# EAGLE design House_Illumination_Core (EAGLE 7.5.0)
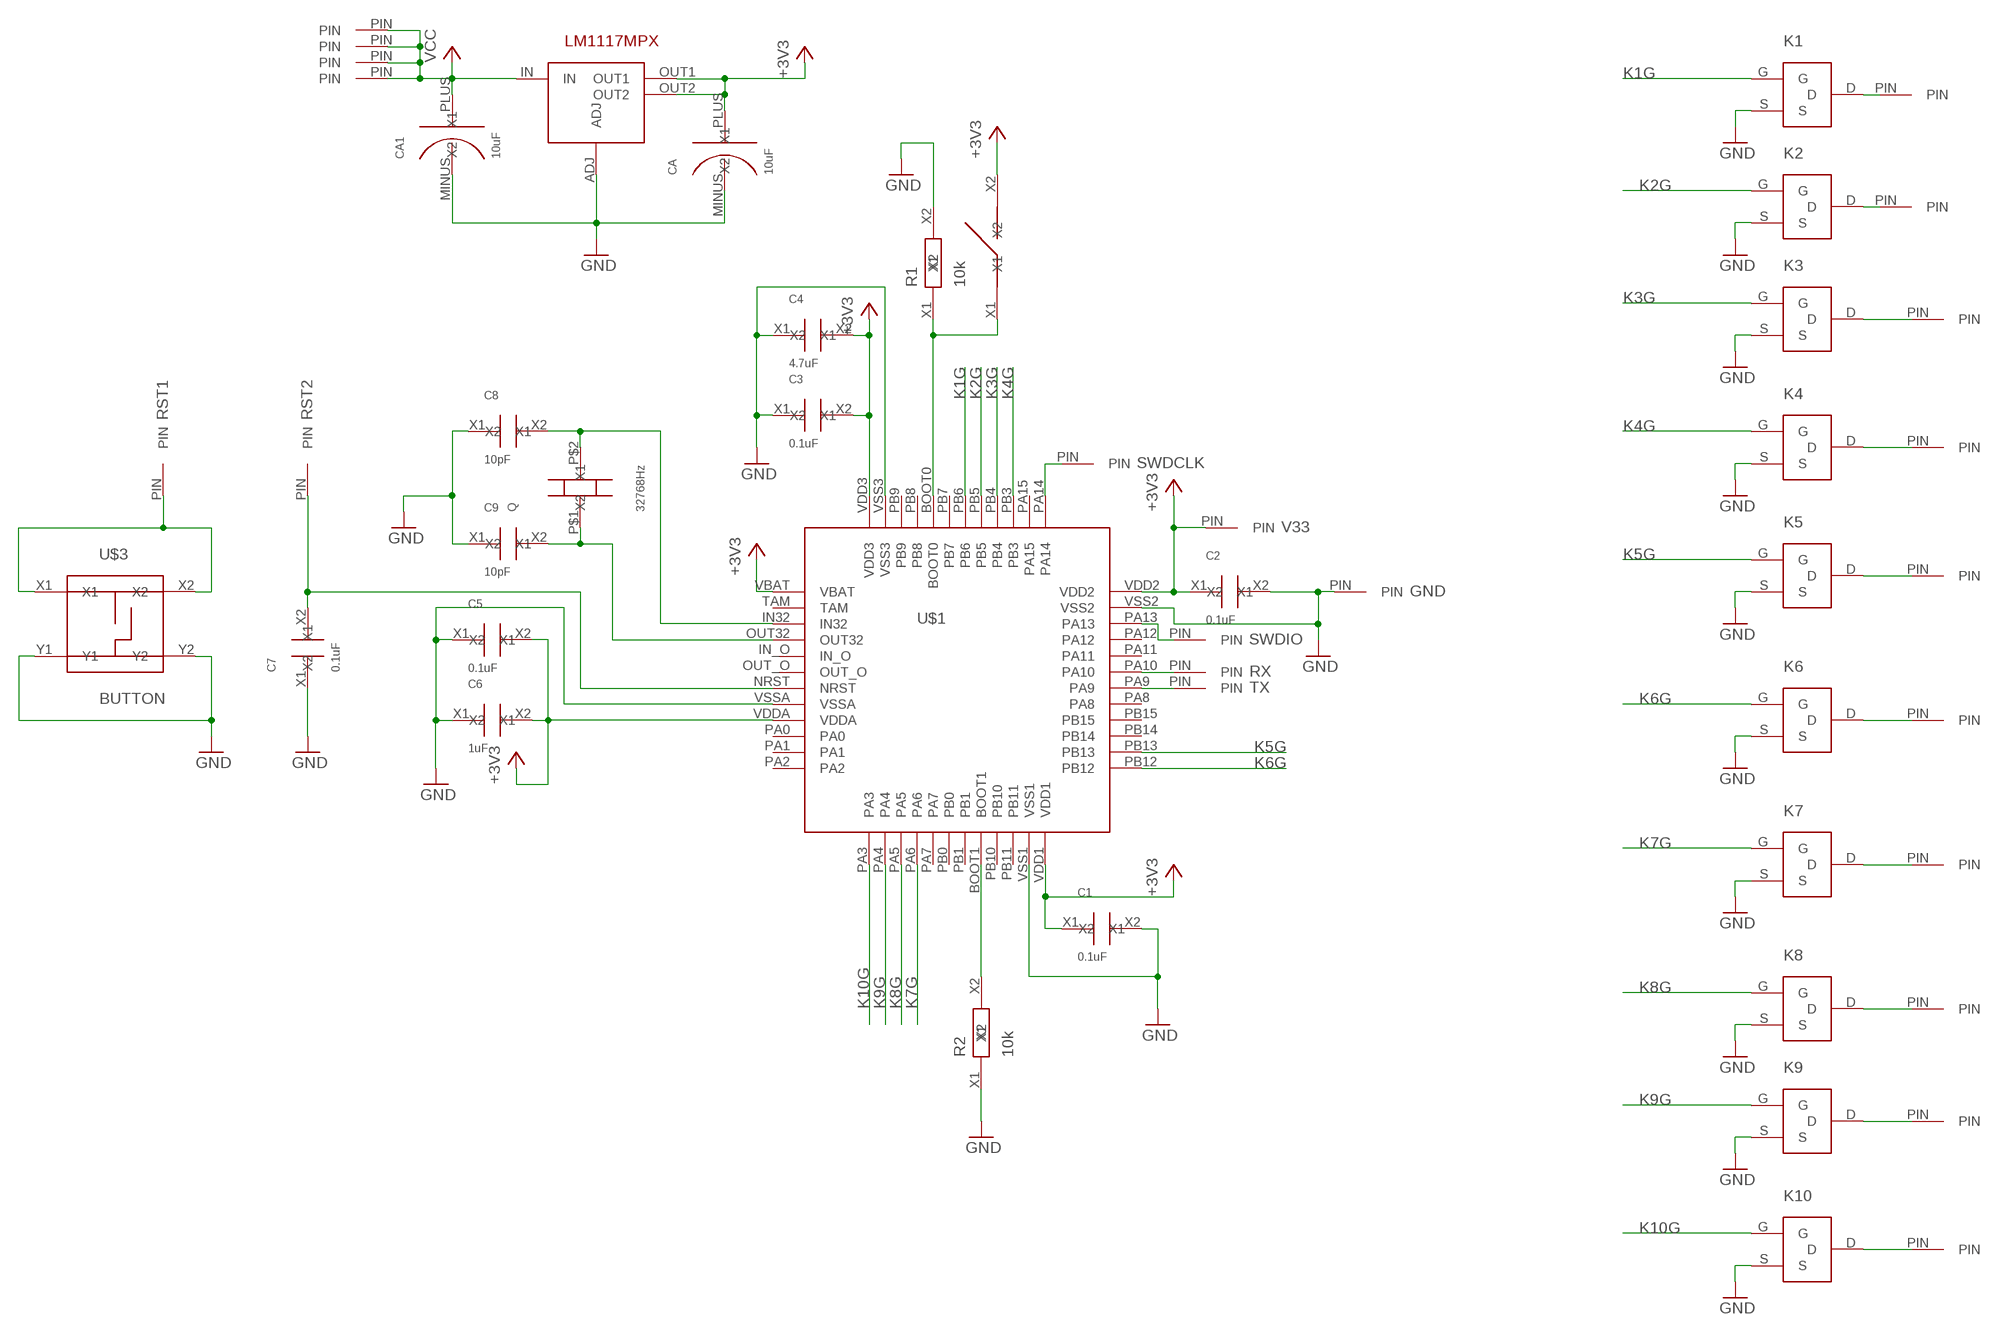
[diagram p0: schematic, sheet 1]

## Parts
C1  0.1uF  C_SMD_2.1X1.25  [SMD_2.1X1.25]
C2  0.1uF  C_SMD_2.1X1.25  [SMD_2.1X1.25]
C3  0.1uF  C_SMD_2.1X1.25  [SMD_2.1X1.25]
C4  4.7uF  C_SMD_2.1X1.25  [SMD_2.1X1.25]
C5  0.1uF  C_SMD_2.1X1.25  [SMD_2.1X1.25]
C6  1uF  C_SMD_2.1X1.25  [SMD_2.1X1.25]
C7  0.1uF  C_SMD_2.1X1.25  [SMD_2.1X1.25]
C8  10pF  C_SMD_2.1X1.25  [SMD_2.1X1.25]
C9  10pF  C_SMD_2.1X1.25  [SMD_2.1X1.25]
CA  10uF  C_SMD_TA_A  [C_SMD_TA_A]
CA1  10uF  C_SMD_TA_A  [C_SMD_TA_A]
GND  PIN  [PIN]
K1  IRFML8244TRPBF  [IRFML8244TRPBF]
K2  IRFML8244TRPBF  [IRFML8244TRPBF]
K3  IRFML8244TRPBF  [IRFML8244TRPBF]
K4  IRFML8244TRPBF  [IRFML8244TRPBF]
K5  IRFML8244TRPBF  [IRFML8244TRPBF]
K6  IRFML8244TRPBF  [IRFML8244TRPBF]
K7  IRFML8244TRPBF  [IRFML8244TRPBF]
K8  IRFML8244TRPBF  [IRFML8244TRPBF]
K9  IRFML8244TRPBF  [IRFML8244TRPBF]
K10  IRFML8244TRPBF  [IRFML8244TRPBF]
LED1  PIN_1  [PIN_1]
LED2  PIN_1  [PIN_1]
LED3  PIN_1  [PIN_1]
LED4  PIN_1  [PIN_1]
LED5  PIN_1  [PIN_1]
LED6  PIN_1  [PIN_1]
LED7  PIN_1  [PIN_1]
LED8  PIN_1  [PIN_1]
LED9  PIN_1  [PIN_1]
LED10  PIN_1  [PIN_1]
Q  32768Hz  QUARTZ_CYL  [QUARTZ_CYL]
R1  10k  R_SMD_2.1X1.25  [SMD_2.1X1.25]
R2  10k  R_SMD_2.1X1.25  [SMD_2.1X1.25]
RST1  PIN  [PIN]
RST2  PIN  [PIN]
RX  PIN  [PIN]
SWDCLK  PIN  [PIN]
SWDIO  PIN  [PIN]
TX  PIN  [PIN]
U$1  STM32F103CBT6  [STM32F103CBT6]
U$2  DIP_1  [DIP_1]
U$3  BUTTON  [BUTTON]
U$13  LM1117MPX-ADJ  [LM1117MPX-ADJ]
V33  PIN  [PIN]
VCCPIN  PIN_1  [PIN_1]
VCCPIN1  PIN_1  [PIN_1]
VCCPIN2  PIN_1  [PIN_1]
VCCPIN3  PIN_1  [PIN_1]

## Nets
+3V3: C1.X1 C2.X1 C3.X2 C4.X2 C5.X2 C6.X2 CA.PLUS(X2) U$1.VBAT U$1.VDD1 U$1.VDD2 U$1.VDD3 U$1.VDDA U$2.X2 U$13.OUT1 U$13.OUT2 V33.PIN
GND: C1.X2 C2.X2 C3.X1 C4.X1 C5.X1 C6.X1 C7.X1 C8.X1 C9.X1 CA1.MINUS(X1) CA.MINUS(X1) GND.PIN K1.S K2.S K3.S K4.S K5.S K6.S K7.S K8.S K9.S K10.S R1.X2 R2.X1 U$1.VSS1 U$1.VSS2 U$1.VSS3 U$1.VSSA U$3.Y1 U$3.Y2 U$13.ADJ
K1G: K1.G U$1.PB6
K2G: K2.G U$1.PB5
K3G: K3.G U$1.PB4
K4G: K4.G U$1.PB3
K5G: K5.G U$1.PB13
K6G: K6.G U$1.PB12
K7G: K7.G U$1.PA6
K8G: K8.G U$1.PA5
K9G: K9.G U$1.PA4
K10G: K10.G U$1.PA3
N$1: R2.X2 U$1.BOOT1
N$2: C9.X2 Q.P$1(X1) U$1.OUT32
N$3: C8.X2 Q.P$2(X2) U$1.IN32
N$4: SWDCLK.PIN U$1.PA14
N$5: C7.X2 RST2.PIN U$1.NRST
N$6: R1.X1 U$1.BOOT0 U$2.X1
N$7: K7.D LED7.PIN
N$8: SWDIO.PIN U$1.PA13
N$9: RX.PIN U$1.PA10
N$10: TX.PIN U$1.PA9
N$11: RST1.PIN U$3.X1 U$3.X2
N$17: K1.D LED1.PIN
N$21: K3.D LED3.PIN
N$22: K4.D LED4.PIN
N$23: K5.D LED5.PIN
N$24: K6.D LED6.PIN
N$25: K10.D LED10.PIN
N$26: K9.D LED9.PIN
N$27: K8.D LED8.PIN
N$28: K2.D LED2.PIN
VCC: CA1.PLUS(X2) U$13.IN VCCPIN1.PIN VCCPIN2.PIN VCCPIN3.PIN VCCPIN.PIN
Unconnected: U$1.IN_O U$1.OUT_O U$1.PA0 U$1.PA1 U$1.PA2 U$1.PA7 U$1.PA8 U$1.PA11 U$1.PA12 U$1.PA15 U$1.PB0 U$1.PB1 U$1.PB7 U$1.PB8 U$1.PB9 U$1.PB10 U$1.PB11 U$1.PB14 U$1.PB15 U$1.TAM

## Library data of the parts
C1-C9 = MyPowerComponents:C_SMD_2.1X1.25
CA CA1 = MyAmSys:C_SMD_TA_A
GND RST1 RST2 RX SWDCLK SWDIO TX V33 = MySTM32F103RGT6:PIN
K1-K10 = My_STM32:IRFML8244TRPBF
LED1-LED10 VCCPIN VCCPIN1-VCCPIN3 = My_BLE:PIN_1
Q = MySTM32F103RGT6:QUARTZ_CYL
R1 R2 = MyPowerComponents:R_SMD_2.1X1.25
U$1 = My_STM32:STM32F103CBT6
U$2 = My_STM32L15x:DIP_1
U$3 = My_STM32:BUTTON
U$13 = My_OPT:LM1117MPX-ADJ

## Board
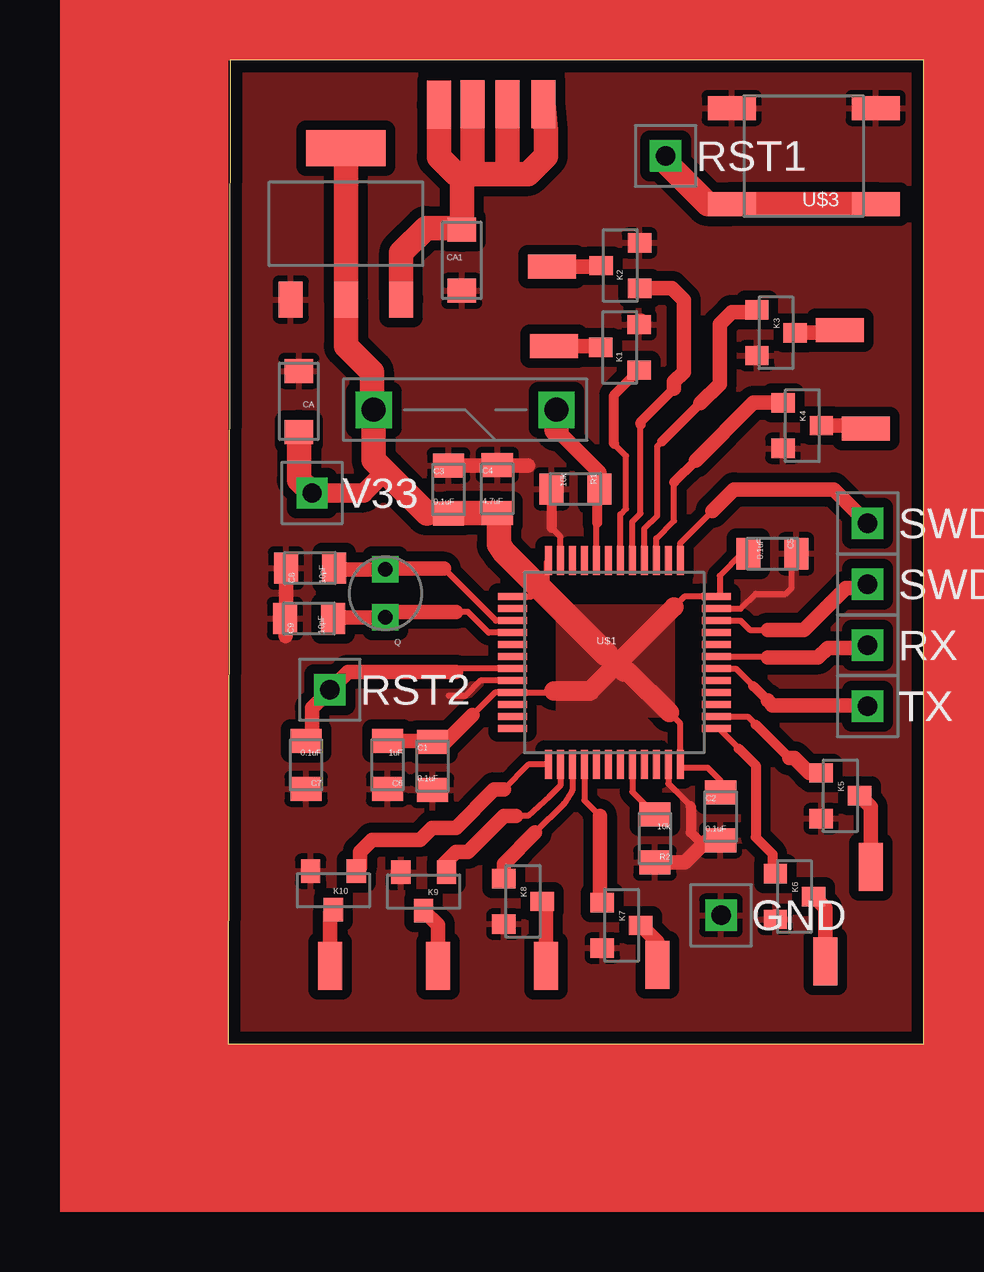
[diagram p1: board, top side]
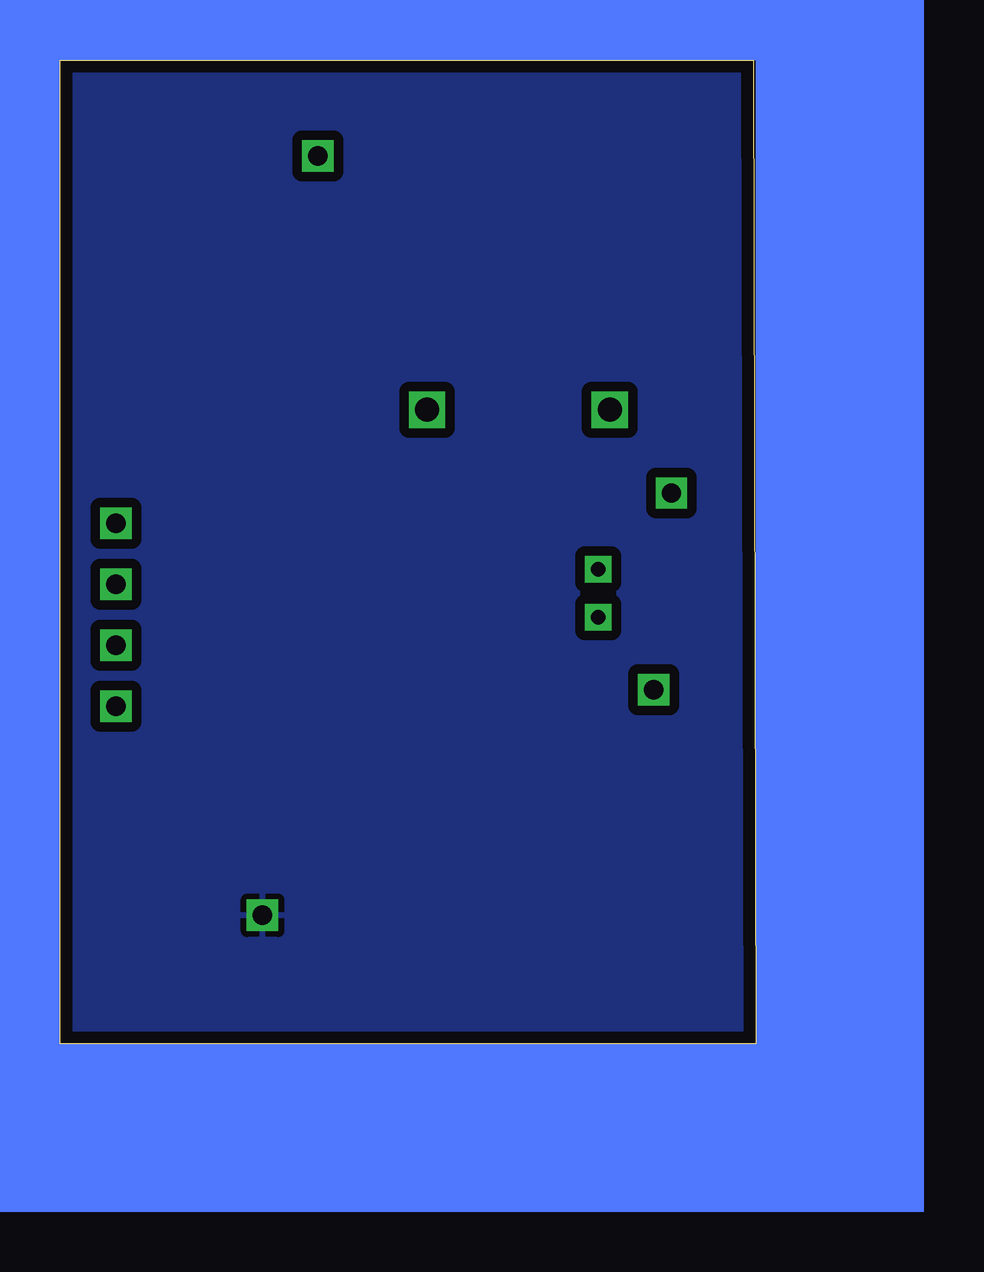
[diagram p2: board, bottom side, seen from below]

Size 29 x 41 mm. Coordinates in mm from the lower left corner, seen from the top.
Outline: 0,0 29,0 29,41 0.1,41 0,0
Copper layers (1*16): Top 0.035mm / dielectric 1.5mm / Bottom 0.035mm
Design rules "default *": minimum track width 10mil, minimum drill 24mil, track to track 8mil, track to pad 8mil, pad to pad 8mil, via to via 8mil, smd to smd 8mil, copper to edge 20mil, drill to drill 8mil, minimum pad ring 10mil, minimum via ring 8mil, stop-mask expansion 4mil, vias tented up to drill 0mil, thermal gap 10mil

### Footprints (pad centres in the part's own frame; a part is rotated, then mirrored left to right if it is on the bottom)
SMD_2.1X1.25 = smd 1.3 x 1: X1 0,1; X2 0,-1
C_SMD_TA_A = smd 1.2 x 1: MINUS 0,-1.27; PLUS 0,1.27
PIN = drill 0.8 square: PIN 0,0
IRFML8244TRPBF = smd 0.802 x 0.972: D 0,0.8; G -0.95,-0.8; S 0.95,-0.8
PIN_1 = smd 2 x 1: PIN 0,0
QUARTZ_CYL = drill 0.6 square: P$1 0,1; P$2 0,-1
STM32F103CBT6 = smd 0.3 x 1.2: BOOT0 -0.75,4.25; BOOT1 0.75,-4.25; PA3 -2.75,-4.25; PA4 -2.25,-4.25; PA5 -1.75,-4.25; PA6 -1.25,-4.25; PA7 -0.75,-4.25; PA14 2.75,4.25; PA15 2.25,4.25; PB0 -0.25,-4.25; PB1 0.25,-4.25; PB3 1.75,4.25; PB4 1.25,4.25; PB5 0.75,4.25; PB6 0.25,4.25; PB7 -0.25,4.25; PB8 -1.25,4.25; PB9 -1.75,4.25; PB10 1.25,-4.25; PB11 1.75,-4.25; VDD1 2.75,-4.25; VDD3 -2.75,4.25; VSS1 2.25,-4.25; VSS3 -2.25,4.25 | smd 1.2 x 0.3: IN32 -4.25,1.75; IN_O -4.25,0.75; NRST -4.25,-0.25; OUT32 -4.25,1.25; OUT_O -4.25,0.25; PA0 -4.25,-1.75; PA1 -4.25,-2.25; PA2 -4.25,-2.75; PA8 4.25,-0.75; PA9 4.25,-0.25; PA10 4.25,0.25; PA11 4.25,0.75; PA12 4.25,1.25; PA13 4.25,1.75; PB12 4.25,-2.75; PB13 4.25,-2.25; PB14 4.25,-1.75; PB15 4.25,-1.25; TAM -4.25,2.25; VBAT -4.25,2.75; VDD2 4.25,2.75; VDDA -4.25,-1.25; VSS2 4.25,2.25; VSSA -4.25,-0.75
DIP_1 = drill 1 square: X1 0,2.54; X2 0,-5.08
BUTTON = smd 2 x 1: X1 -3,2; X2 3,2; Y1 -3,-2; Y2 3,-2
LM1117MPX-ADJ = smd 1 x 1.5: ADJ -2.3,-6.3; IN 2.3,-6.3; OUT1 0,-6.3 | smd 3.3 x 1.5: OUT2 0,0

### Placement (x,y rotation side)
C1  8.53,11.57 0 top
C2  20.54,9.47 0 top
C3  9.2,23.1 0 top
C4  11.23,23.12 0 top
C5  22.69,20.42 270 top
C6  6.65,11.62 180 top
C7  3.26,11.62 180 top
C8  3.42,19.82 90 top
C9  3.38,17.72 90 top
CA  2.96,26.77 180 top
CA1  9.75,32.65 0 top
GND  20.56,5.35 0 top
K1  16.34,29.02 90 top
K2  16.36,32.43 90 top
K3  22.85,29.63 270 top
K4  23.94,25.76 270 top
K5  25.53,10.33 270 top
K6  23.62,6.13 270 top
K7  16.41,4.93 270 top
K8  12.3,5.93 270 top
K9  8.16,6.34 180 top
K10  4.4,6.39 180 top
LED1  13.6,29.08 180 top
LED2  13.5,32.39 0 top
LED3  25.5,29.75 0 top
LED4  26.6,25.64 0 top
LED5  26.8,7.37 90 top
LED6  24.9,3.43 270 top
LED7  17.9,3.29 270 top
LED8  13.25,3.25 90 top
LED9  8.75,3.25 90 top
LED10  4.25,3.25 270 top
Q  6.57,18.77 180 top
R1  14.49,23.12 270 top
R2  17.8,8.55 180 top
RST1  18.25,37 0 top
RST2  4.25,14.75 0 top
RX  26.67,16.61 0 top
SWDCLK  26.67,21.68 0 top
SWDIO  26.67,19.14 0 top
TX  26.67,14.06 0 top
U$1  16.11,15.88 0 top
U$2  11.16,26.42 270 top
U$3  24,37 180 top
U$13  4.92,37.32 0 top
V33  3.51,22.95 0 top
VCCPIN  8.8,39.13 90 top
VCCPIN1  10.2,39.15 90 top
VCCPIN2  11.65,39.15 90 top
VCCPIN3  13.15,39.15 90 top

### Tracks (layer width: path | path; a pad name or v marks a point on that pad's centre or on a via)
+3V3
  Top 0.254: 10.2,13.7 11.13,14.63 U$1.VDDA 13.53,14.63 13.6,14.7 | U$1.VDD1 | U$1.VDD2 20.83,18.63 | U$1.VBAT 12.63,18.63 13,19 13.3,19.3 13.3,20.07 U$1.VDD3 | U$1.VDD2 19.03,18.63 18.6,18.2 | U$1.VDD1 18.86,13.34 18.4,13.8 | C5.X2 21.42,20.42 20.5,19.5 20.5,18.77 U$1.VDD2 | C2.X1 20.54,10.96 20,11.5 18.99,11.5 U$1.VDD1
  Top 0.305: 13.4,18.6 13,19
  Top 0.406: 11.3,22.05 C4.X2 | 13.8,18.2 13.4,18.6
  Top 0.61: 10.2,13.7 9.07,12.57 C1.X1 8.48,12.62 C6.X2 | 9.72,22.12 C3.X2
  Top 0.813: 8.3,22.1 C3.X2 | 18.6,18.2 16.2,15.8 | 16.2,15.8 15.75,16.25 13.8,18.2 | 13.6,14.7 15.1,14.7 16.2,15.8 | 18.4,13.8 16.7,15.5 16.5,15.5 16.2,15.8 | 6.55,23.85 5.65,22.95 V33.PIN 3.46,23
  Top 1.016: 8.3,22.1 6.55,23.85 6.08,24.32 U$2.X2 6,26.5 6,28 4.92,29.08 U$13.OUT1 U$13.OUT2 | 11.3,22.05 11.3,20.8 11.5,20.5 15.75,16.25 | C4.X2 9.22,22.12 C3.X2 | CA.PLUS 2.96,23.5 V33.PIN
  Bottom 0.813: 6,26.5 U$2.X2
  pour Top (isolate 0.406): 13.8,18.2 18.5,18.2 18.5,13.7 13.8,13.7
GND
  Top 0.254: U$1.VSSA 10.53,15.13 9.9,14.5 9.2,14.5 | U$1.VSS1 18.36,10.84 19.3,9.9 | U$1.VSS3 13.86,21.14 13.5,21.5 | C5.X1 23.5,20.23 23.5,19 23.25,18.75 22,18.75 21.38,18.13 U$1.VSS2
  Top 0.406: 19.3,9.9 19.3,8.8 19.7,8.4 19.9,8.4 20.47,8.4 C2.X2 | 13.5,21.5 R1.X2
  Top 0.61: C8.X1 2.42,17.76 C9.X1 2.4,17.7 2.4,17 | R2.X1 19.05,7.55 19.9,8.4 | C3.X1 11.71,24.1 C4.X1 11.75,24.1 12.5,24.1 | R1.X2
  Top 0.813: 17.2,30.03 K1.S | 22.8,5.2 K6.S
  pour Bottom (isolate 0.406): 0,0 29,0 29,41 0,41
  pour Top (isolate 0.406): 0,0 29,0 29,41 0,41
K1G
  Top 0.254: U$1.PB6 16.36,22.06 16.6,22.3 16.6,24.5 16.1,25
  Top 0.406: 16.1,25 16.1,27.03 K1.G
K2G
  Top 0.254: U$1.PB5 16.86,21.76 17.2,22.1 17.2,25.8
  Top 0.406: 17.2,25.8 17.2,25.9 18.6,27.3
  Top 0.61: 18.6,27.3 18.6,27.6 19,28 19,31 18.5,31.5 17.18,31.5 K2.G
K3G
  Top 0.254: U$1.PB4 17.36,21.46 17.9,22 17.9,24.9 18.1,25.1
  Top 0.406: 18.1,25.1 19.7,26.7
  Top 0.61: 19.7,26.7 20.5,27.5 20.5,30 21,30.5 21.97,30.5 K3.G
K4G
  Top 0.254: U$1.PB3 17.86,21.06 18.6,21.8 18.6,23.4
  Top 0.406: 18.6,23.4 19.5,24.3
  Top 0.61: 19.5,24.3 21.91,26.71 K4.G
K5G
  Top 0.254: U$1.PB13 21.67,13.63 22,13.3
  Top 0.406: 22,13.3 23.4,11.9
  Top 0.61: 23.4,11.9 23.61,11.9 24.23,11.28 K5.G
K6G
  Top 0.254: U$1.PB12 20.47,13.13 21.3,12.3
  Top 0.406: 21.3,12.3 22,11.6 22,8.6 22.7,7.9 22.7,7.2 K6.G
K7G
  Top 0.254: U$1.PA6 14.86,10.14 15.5,9.5
  Top 0.61: 15.5,9.5 15.5,5.99 K7.G
K8G
  Top 0.254: U$1.PA5 14.36,10.56 14,10 12.8,8.8
  Top 0.61: 12.8,8.8 11.5,7.5 K8.G
K9G
  Top 0.254: U$1.PA4 13.86,10.76 13.4,10.3 12.5,9.5 12,9.5
  Top 0.61: K9.G 9,7.25 9,7.5 9.5,8 10,8 11.5,9.5 12,9.5
K10G
  Top 0.254: U$1.PA3 12.53,11.63 11.5,10.6
  Top 0.61: 11.5,10.6 11.1,10.6 9.5,9 8.5,9 8,8.5 6,8.5 5.5,8 5.5,7.34 K10.G
N$1
  Top 0.254: U$1.BOOT1 16.86,10.49 R2.X2
N$2
  Top 0.254: U$1.OUT32 10.87,17.13 10,18 9.5,18
  Top 0.61: C9.X2 4.43,17.77 Q.P$1 6.8,18 9.5,18
N$3
  Top 0.254: U$1.IN32 11.17,17.63 9,19.8
  Top 0.61: 9,19.8 6.6,19.8 Q.P$2 4.47,19.77 C8.X2
N$4
  Top 0.254: U$1.PA14 18.86,20.86 20.2,22.2
  Top 0.61: 20.2,22.2 21.1,23.1 25.25,23.1 SWDCLK.PIN
N$5
  Top 0.254: U$1.NRST 9.63,15.63 9.5,15.5
  Top 0.61: 9.5,15.5 5,15.5 4.75,15.25 RST2.PIN 3.5,14 3.5,12.86 C7.X2
N$6
  Top 0.254: U$1.BOOT0 15.36,21.66 15.4,21.7
  Top 0.406: 15.4,21.7 15.4,23.03 R1.X1
  Top 0.61: R1.X1 15.49,23.81 13.7,25.6
  Top 1.016: 13.7,25.6 U$2.X1
N$7
  Top 0.61: LED7.PIN 17.9,4.24 K7.D
N$8
  Top 0.254: U$1.PA13 21.37,17.63 21.75,17.25 22.5,17.25
  Top 0.61: SWDIO.PIN 26.52,19 25.75,19 24,17.25 22.5,17.25
N$9
  Top 0.254: U$1.PA10 22.47,16.13 22.5,16.1
  Top 0.61: 22.5,16.1 24.6,16.1 25,16.5 26.57,16.5 RX.PIN
N$10
  Top 0.254: U$1.PA9 21.17,15.63 21.9,14.9
  Top 0.406: 21.9,14.9 22.5,14.3
  Top 0.61: 22.5,14.3 22.7,14.1 26.64,14.1 TX.PIN
N$11
  Top 1.016: U$3.X1 21.5,35 U$3.X2 20,35 18.25,36.75 RST1.PIN
N$17
  Top 0.61: LED1.PIN 15.48,29.08 K1.D
N$21
  Top 0.61: K3.D 25.38,29.63 LED3.PIN
N$22
  Top 0.61: K4.D 26.48,25.76 LED4.PIN
N$23
  Top 0.61: LED5.PIN 26.8,9.86 K5.D
N$24
  Top 0.61: LED6.PIN 24.9,5.65 K6.D
N$25
  Top 0.61: LED10.PIN 4.25,5.44 K10.D
N$26
  Top 0.61: LED9.PIN 8.75,4.95 K9.D
N$27
  Top 0.61: LED8.PIN 13.25,5.78 K8.D
N$28
  Top 0.61: LED2.PIN 15.52,32.39 K2.D
VCC
  Top 1.016: VCCPIN.PIN 8.8,36.95 9.5,36.25 9.75,36.25 | 9.75,36.25 10.25,36.25 | 10.25,36.25 11.5,36.25 | 11.5,36.25 12.5,36.25 13.25,37 13.25,38.05 VCCPIN3.PIN | VCCPIN1.PIN 10.2,36.3 10.25,36.25 | VCCPIN2.PIN 11.65,36.4 11.5,36.25 | 9.75,36.25 CA1.PLUS 9.67,34 8.25,34 7.22,32.97 U$13.IN
(copper drawn outside any net)
  shapes: Bottom area x4, Top area x5